# EAGLE design microPOV-a (EAGLE 6.4)
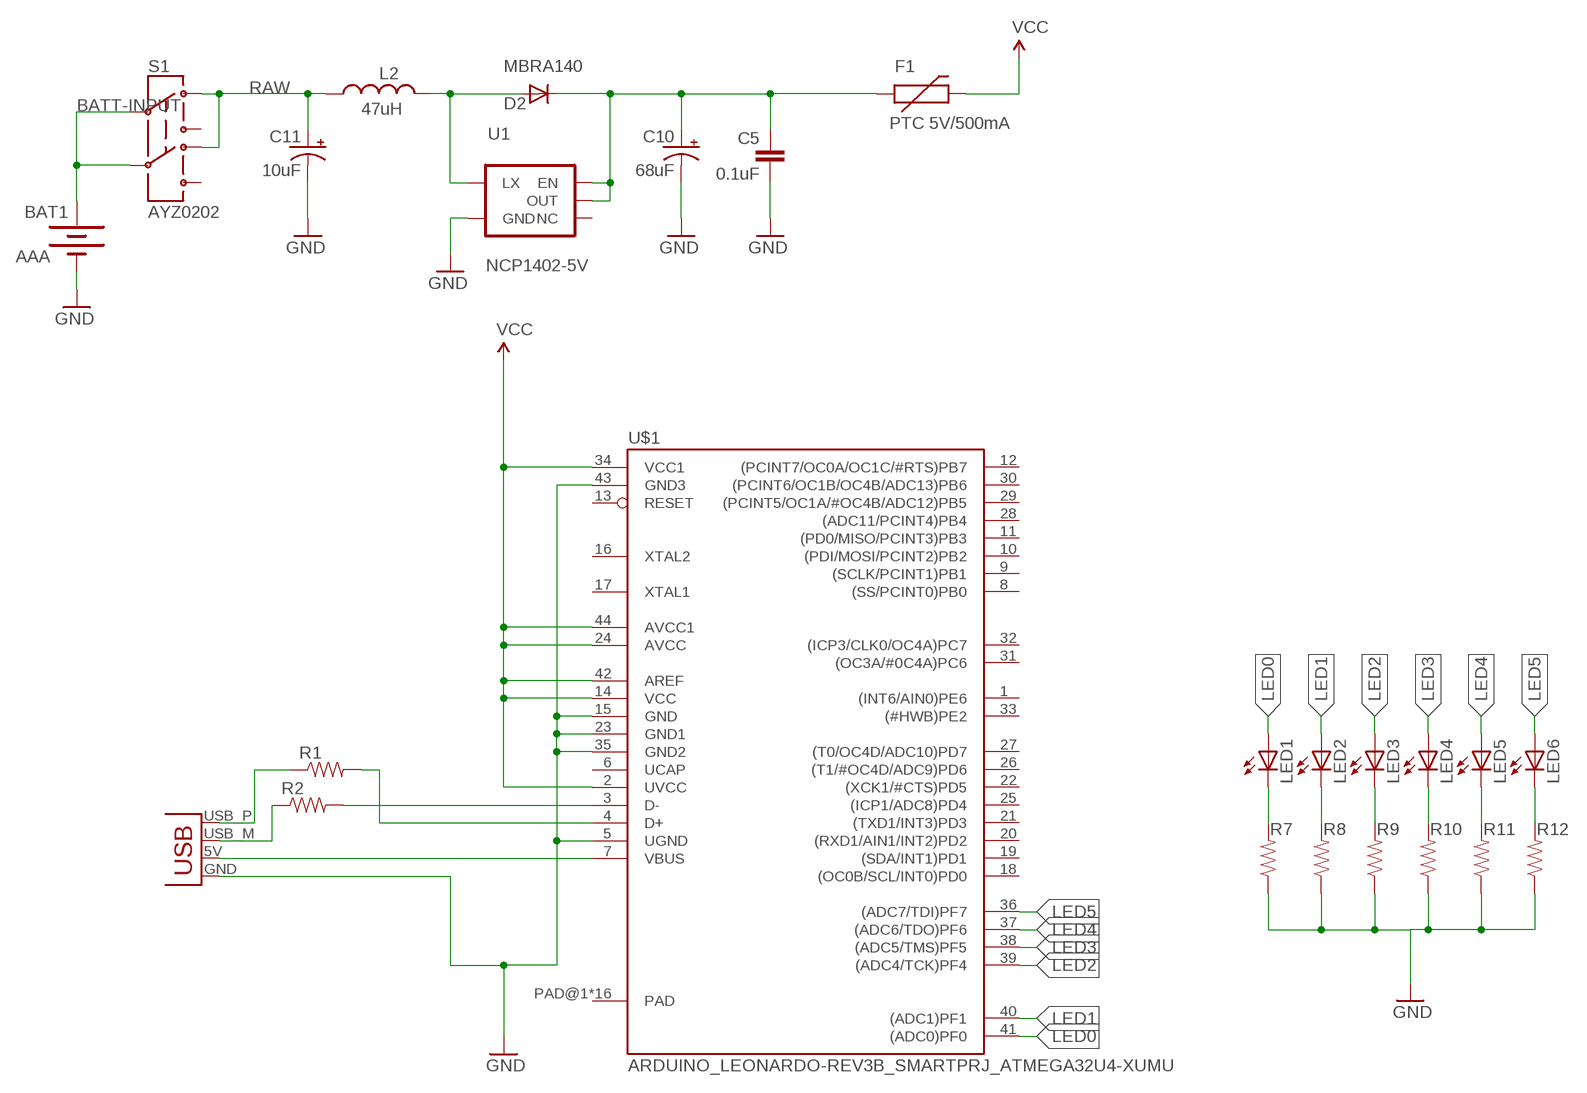
[diagram p0: schematic, sheet 1]

## Parts
BAT1  AAA  BATTERYAAA  [BATTERY-AAA]
C5  0.1uF  CAP0603-CAP  [0603-CAP]
C10  68uF  CAP_POL2  [EIA3528-21]
C11  10uF  CAP_POL1206  [CPOL_1206]
D2  MBRA140  DIODESMA  [SMA-DIODE]
F1  PTC 5V/500mA  PTCSMD  [PTC-1206]
JP1  USBPCB  [USB-A-PCB]
L2  47uH  INDUCTORCR54  [CR54]
LED1  LEDCHIPLED_1206  [CHIPLED_1206]
LED2  LEDCHIPLED_1206  [CHIPLED_1206]
LED3  LEDCHIPLED_1206  [CHIPLED_1206]
LED4  LEDCHIPLED_1206  [CHIPLED_1206]
LED5  LEDCHIPLED_1206  [CHIPLED_1206]
LED6  LEDCHIPLED_1206  [CHIPLED_1206]
R1  RESISTOR0402-RES  [0402-RES]
R2  RESISTOR0402-RES  [0402-RES]
R7  RESISTOR0402-RES  [0402-RES]
R8  RESISTOR0402-RES  [0402-RES]
R9  RESISTOR0402-RES  [0402-RES]
R10  RESISTOR0402-RES  [0402-RES]
R11  RESISTOR0402-RES  [0402-RES]
R12  RESISTOR0402-RES  [0402-RES]
S1  AYZ0202  [AYZ0202]
U1  NCP1402-5V  V_REG_NCP1400SOT23-5  [SOT23-5]
U$1  ARDUINO_LEONARDO-REV3B_SMARTPRJ_ATMEGA32U4-XUMU  [ARDUINO_LEONARDO-REV3B_SMARTPRJ_QFN44ML7X7]

## Nets
BATT-INPUT: BAT1.PWR@1(+) S1.2 S1.5
GND: BAT1.GND@1(-) C5.2 C10.C(-) C11.C(-) JP1.GND R7.1 R8.1 R9.1 R10.1 R11.1 R12.1 U1.4(GND) U$1.5(UGND) U$1.15(GND) U$1.23(GND1) U$1.35(GND2) U$1.43(GND3)
LED0: LED1.A U$1.41((ADC0)PF0)
LED1: LED2.A U$1.40((ADC1)PF1)
LED2: LED3.A U$1.39((ADC4/TCK)PF4)
LED3: LED4.A U$1.38((ADC5/TMS)PF5)
LED4: LED5.A U$1.37((ADC6/TDO)PF6)
LED5: LED6.A U$1.36((ADC7/TDI)PF7)
N$1: JP1.5V(VBUS) U$1.7(VBUS)
N$2: C5.1 C10.A(+) D2.C F1.1 U1.1(EN) U1.2(OUT)
N$4: JP1.USB_P(D+) R1.1
N$5: R1.2 U$1.4(D+)
N$6: JP1.USB_M(D-) R2.1
N$7: R2.2 U$1.3(D-)
N$8: LED1.C R7.2
N$9: LED2.C R8.2
N$10: LED3.C R9.2
N$11: LED4.C R10.2
N$12: LED5.C R11.2
N$13: LED6.C R12.2
N$16: D2.A L2.P$1 U1.5(LX)
RAW: C11.A(+) L2.P$2 S1.3 S1.6
VCC: F1.2 U$1.2(UVCC) U$1.14(VCC) U$1.24(AVCC) U$1.34(VCC1) U$1.42(AREF) U$1.44(AVCC1)
Unconnected: S1.1 S1.4 U1.3(NC) U$1.1((INT6/AIN0)PE6) U$1.6(UCAP) U$1.8((SS/PCINT0)PB0) U$1.9((SCLK/PCINT1)PB1) U$1.10((PDI/MOSI/PCINT2)PB2) U$1.11((PD0/MISO/PCINT3)PB3) U$1.12((PCINT7/OC0A/OC1C/#RTS)PB7) U$1.13(RESET) U$1.16(XTAL2) U$1.17(XTAL1) U$1.18((OC0B/SCL/INT0)PD0) U$1.19((SDA/INT1)PD1) U$1.20((RXD1/AIN1/INT2)PD2) U$1.21((TXD1/INT3)PD3) U$1.22((XCK1/#CTS)PD5) U$1.25((ICP1/ADC8)PD4) U$1.26((T1/#OC4D/ADC9)PD6) U$1.27((T0/OC4D/ADC10)PD7) U$1.28((ADC11/PCINT4)PB4) U$1.29((PCINT5/OC1A/#OC4B/ADC12)PB5) U$1.30((PCINT6/OC1B/OC4B/ADC13)PB6) U$1.31((OC3A/#0C4A)PC6) U$1.32((ICP3/CLK0/OC4A)PC7) U$1.33((#HWB)PE2)

## Power pins joined to a net without a drawn wire
PAD: U$1.PAD@1(PAD) U$1.PAD@2(PAD) U$1.PAD@3(PAD) U$1.PAD@4(PAD) U$1.PAD@5(PAD) U$1.PAD@6(PAD) U$1.PAD@7(PAD) U$1.PAD@8(PAD) U$1.PAD@9(PAD) U$1.PAD@10(PAD) U$1.PAD@11(PAD) U$1.PAD@12(PAD) U$1.PAD@13(PAD) U$1.PAD@14(PAD) U$1.PAD@15(PAD) U$1.PAD@16(PAD)

## Library data of the parts
BAT1 = SparkFun:BATTERY: Battery Holders Various common sizes : AA, AAA, 20mm coin cell and 12mm coin cell.
C5 = SparkFun:CAP: Capacitor Standard 0603 ceramic capacitor, and 0.1" leaded capacitor.
C10 C11 = SparkFun-Nate:CAP_POL
D2 = SparkFun-Nate:DIODE
F1 = SparkFun:PTC: Resettable Fuse PTC Resettable Fuse. Spark Fun Electronics SKU : COM-08357
JP1 = SparkFun-Connectors:USB: USB Connectors USB-B-PTH is fully proven SKU : PRT-00139/CONN-08278 USB-miniB is fully proven SKU : PRT-00587 USB-A-PCB is untested. USB-A-H is throughly reviewed, but untested. Spark Fun Electronics SKU : PRT-00437 USB-B-SMT is throughly reviewed, but untested. Needs silkscreen touching up. USB-A-S has not been used/tested USB-MB-H has not been used/tested USB-MICROB has been used. CONN-09505
L2 = SparkFun-Nate:INDUCTOR: Basic Inductor/Choke - 0603 and 1206
LED1-LED6 = adafruit:LED: LED OSRAM: - CHIPLED LG R971, LG N971, LY N971, LG Q971, LY Q971, LO R971, LY R971 LH N974, LH R974 LS Q976, LO Q976, LY Q976 LO Q996 - Hyper CHIPLED LW Q18S LB Q993, LB Q99A, LB R99A - SideLED LS A670, LO A670, LY A670, LG A670, LP A670 LB A673, LV A673, LT A673, LW A673 LH A674 LY A675 LS A676, LA A676, LO A676, LY A676, LW A676 LS A679, LY A679, LG A679 - Hyper Micro SIDELED® LS Y876, LA Y876, LO Y876, LY Y876 LT Y87S - SmartLED LW L88C, LW L88S LB L89C, LB L89S, LG L890 LS L89K, LO L89K, LY L89K LS L896, LA L896, LO L896, LY L896 - TOPLED LS T670, LO T670, LY T670, LG T670, LP T670 LSG T670, LSP T670, LSY T670, LOP T670, LYG T670 LG T671, LOG T671, LSG T671 LB T673, LV T673, LT T673, LW T673 LH T674 LS T676, LA T676, LO T676, LY T676, LB T676, LH T676, LSB T676, LW T676 LB T67C, LV T67C, LT T67C, LS T67K, LO T67K, LY T67K, LW E67C LS E67B, LA E67B, LO E67B, LY E67B, LB E67C, LV E67C, LT E67C LW T67C LS T679, LY T679, LG T679 LS T770, LO T770, LY T770, LG T770, LP T770 LB T773, LV T773, LT T773, LW T773 LH T774 LS E675, LA E675, LY E675, LS T675 LS T776, LA T776, LO T776, LY T776, LB T776 LHGB T686 LT T68C, LB T68C - Hyper Mini TOPLED® LB M676 - Mini TOPLED Santana® LG M470 LS M47K, LO M47K, LY M47K Source: http://www.osram.convergy.de/
R1 R2 = SparkFun-Passives:RESISTOR: Resistor Basic schematic elements and footprints for 0603, 1206, and PTH resistors.
R7-R12 = SparkFun:RESISTOR: Resistor Basic schematic elements and footprints for 0603, 1206, and PTH resistors.
S1 = SparkFun:AYZ0202: SPDT Slide Switch Simple SMD single-pull double-throw slide switch. Good for less than 350mA power switch, switching UARTs between devices, etc. Spark Fun Electronics SKU : COM-00597
U1 = SparkFun:V_REG_NCP1400: Switching step-up voltage regulator NCP1400 switiching regulator takes single cell AA and outputs 100mA at 3.3V or 5V with minimal number of external components.
U$1 = blinkiverse:ARDUINO_LEONARDO-REV3B_SMARTPRJ_ATMEGA32U4-XU

## Board
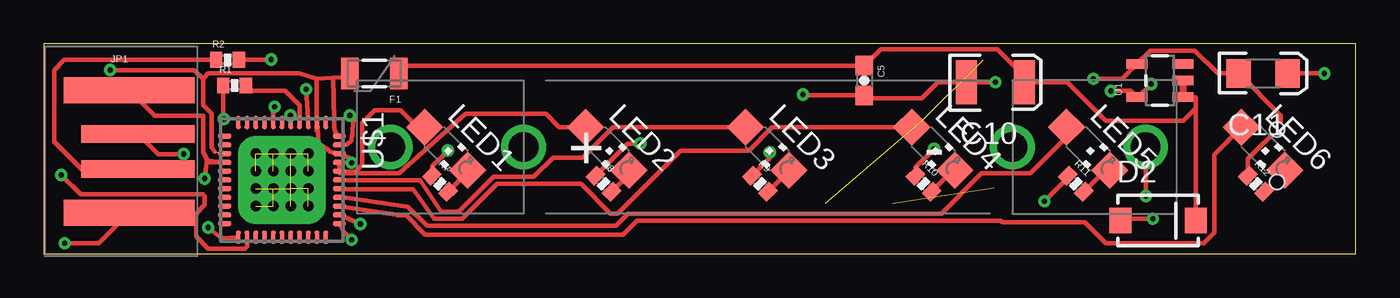
[diagram p1: board, top side]
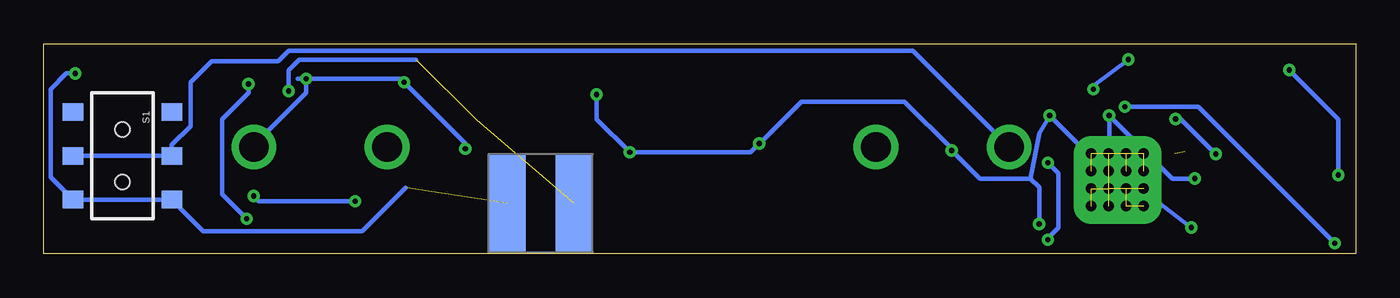
[diagram p2: board, bottom side, seen from below]

Size 75 x 12 mm. Coordinates in mm from the lower left corner, seen from the top.
Outline: 0,0 75,0 75,12 0,12 0,0
Copper layers (1*16): Top 0.035mm / dielectric 1.5mm / Bottom 0.035mm
Design rules "default": minimum track width 10mil, minimum drill 24mil, track to track 8mil, track to pad 8mil, pad to pad 8mil, via to via 8mil, smd to smd 8mil, copper to edge 40mil, drill to drill 8mil, minimum pad ring 10mil, minimum via ring 8mil, stop-mask expansion 4mil, vias tented up to drill 0mil, thermal gap 10mil

### Footprints (pad centres in the part's own frame; a part is rotated, then mirrored left to right if it is on the bottom)
BATTERY-AAA = drill 1.702: GND@1 21.59,0; GND@2 13.97,0; PWR@1 -21.59,0; PWR@2 -13.97,0
0603-CAP = smd 1.1 x 1: 1 -0.85,0; 2 0.85,0
EIA3528-21 = smd 2.5 x 1.2: A 0,-1.65; C 0,1.65
CPOL_1206 = smd 1.6 x 1.4: A 0,-1.4; C 0,1.4
SMA-DIODE = smd 1.27 x 1.47: A -2.15,0; C 2.15,0
PTC-1206 = smd 1 x 1.8: 1 -1.4,0; 2 1.4,0
USB-A-PCB = smd 7.5 x 1.5: 5V -0.2,-3.5; GND -0.2,3.5 | smd 6.5 x 1: USB_M 0.3,-1; USB_P 0.3,1
CR54 = smd 5.5 x 2.15: P$1 0,1.92; P$2 0,-1.92
CHIPLED_1206 = smd 1.5 x 1.5: A 0,-1.75; C 0,1.75
0402-RES = smd 0.7 x 0.9: 1 -0.65,0; 2 0.65,0
AYZ0202 = smd 1 x 1.15: 1 -2.5,2.825; 2 0,2.825; 3 2.5,2.825; 4 -2.5,-2.825; 5 0,-2.825; 6 2.5,-2.825 | hole 0.85: 1.5,0; -1.5,0
SOT23-5 = smd 0.55 x 1.2: 1 -0.95,-1.3; 2 0,-1.3; 3 0.95,-1.3; 4 0.95,1.3; 5 -0.95,1.3
ARDUINO_LEONARDO-REV3B_SMARTPRJ_QFN44ML7X7 = smd 0.75 x 0.275: 1 -3.275,2.5; 2 -3.275,2; 3 -3.275,1.5; 4 -3.275,1; 5 -3.275,0.5; 6 -3.275,0; 7 -3.275,-0.5; 8 -3.275,-1; 9 -3.275,-1.5; 10 -3.275,-2; 11 -3.275,-2.5; 23 3.275,-2.5; 24 3.275,-2; 25 3.275,-1.5; 26 3.275,-1; 27 3.275,-0.5; 28 3.275,0; 29 3.275,0.5; 30 3.275,1; 31 3.275,1.5; 32 3.275,2; 33 3.275,2.5 | smd 0.275 x 0.75: 12 -2.5,-3.275; 13 -2,-3.275; 14 -1.5,-3.275; 15 -1,-3.275; 16 -0.5,-3.275; 17 0,-3.275; 18 0.5,-3.275; 19 1,-3.275; 20 1.5,-3.275; 21 2,-3.275; 22 2.5,-3.275; 34 2.5,3.275; 35 2,3.275; 36 1.5,3.275; 37 1,3.275; 38 0.5,3.275; 39 0,3.275; 40 -0.5,3.275; 41 -1,3.275; 42 -1.5,3.275; 43 -2,3.275; 44 -2.5,3.275 | drill 0.6 pad 2: PAD@1 -1.5,1.5; PAD@4 1.5,1.5; PAD@13 -1.5,-1.5; PAD@16 1.5,-1.5 | drill 0.6 pad 2 square: PAD@2 -0.5,1.5; PAD@3 0.5,1.5; PAD@5 -1.5,0.5; PAD@8 1.5,0.5; PAD@9 -1.5,-0.5; PAD@12 1.5,-0.5; PAD@14 -0.5,-1.5; PAD@15 0.5,-1.5 | drill 0.6 pad 1 square: PAD@6 -0.5,0.5; PAD@7 0.5,0.5; PAD@10 -0.5,-0.5; PAD@11 0.5,-0.5

### Placement (x,y rotation side)
BAT1  41.4,6.1 0 top
C5  46.9,9.9 270 top
C10  54.4,9.8 90 top
C11  69.7,10.3 90 top
D2  63.7,1.9 0 top
F1  18.9,10.3 180 top
JP1  5.08,5.85 0 top
L2  46.6,2.9 270 bottom
LED1  23,6 225 top
LED2  32.21,6 225 top
LED3  41.35,6 225 top
LED4  50.85,6 225 top
LED5  59.71,6 225 top
LED6  69.71,6 225 top
R1  10.91,9.62 0 top
R2  10.51,11.08 0 top
R7  22.65,4 315 top
R8  32,4 315 top
R9  40.94,4 315 top
R10  50.29,4 315 top
R11  59,4 315 top
R12  69.29,4 315 top
S1  70.5,5.6 270 bottom
U1  63.8,9.9 90 top
U$1  13.62,4.22 270 top

### Tracks (layer width: path | path; a pad name or v marks a point on that pad's centre or on a via)
BATT-INPUT
  Bottom 0.254: S1.5 S1.2 67.67,6.22 66.6,7.3 66.6,9.8 65.4,11 61.6,11 61,11.6 25.31,11.6 BAT1.PWR@1
GND  (via drill 0.3)
  Top 0.254: v60,10 61.65,10 U1.4 63.25,11.6 65.8,11.6 67.1,10.3 C11.C 70.7,7.9 70.7,7.3 68.83,5.43 R12.1 | BAT1.GND@1 v63,3.3 | v57.2,3 58.54,4.34 R11.1 | v54.4,9.8 C10.C 51.1,9.8 50.2,8.9 47.05,8.9 C5.2 43.45,9.05 v43.4,9.1 | v50.9,6 49.83,4.93 R10.1 | R9.1 41.5,5.48 v41.5,5.8 | R8.1 33.38,6.3 v34.1,6.3 | R7.1 22.19,4.99 v23.1,5.9 | U$1.5 14.12,7.88 v14.1,7.9 | v9.4,1.5 10.18,0.9 U$1.23 | JP1.GND 6.33,7.9 9.1,7.9 9.1,5.8 9.38,5.32 U$1.15 9.32,5.22 v9.2,4.3 | U$1.43 17.32,6.22 17.6,6.5 17.7,7.7 v17.5,7.9 | U$1.35 18.08,1.72 v18.1,1.7
  Bottom 0.254: BAT1.GND@1 62.99,6.21 60,9.2 v60,10 | v63,3.3 62.7,3 v57.2,3 | v50.9,6 50.9,6.3 v54.4,9.8 54.6,10 v60,10 | 60.5,10 v60,10 | v43.4,9.1 43.4,7.7 v41.5,5.8 34.6,5.8 v34.1,6.3 31.7,8.7 25.8,8.7 23.1,6 v23.1,5.9 21.5,4.3 18.6,4.3 | 14.1,5.1 v14.1,7.9 10.5,4.3 v9.2,4.3 | 14.1,5.1 v9.4,1.5 | 18.6,4.3 18.1,6.9 v17.5,7.9 14.7,5.1 14.1,5.1 | v18.1,1.7 18.1,3.8 18.6,4.3
LED0
  Top 0.254: LED1.A 21.36,7.24 20.4,8.2 18.9,8.2 18.2,7.5 18.2,5.1 17.8,4.7 16.91,4.7 U$1.41
LED1
  Top 0.254: LED2.A 29.46,7.24 28.7,8 24.1,8 20.3,4.6 16.91,4.6 U$1.40
LED2
  Top 0.254: LED3.A 32.54,7.24 30.8,5.5 29.1,5.5 28,4.4 25.7,4.4 23.7,2.4 22.7,2.4 21.5,4.2 17.18,4.2 U$1.39
LED3
  Top 0.254: LED4.A 41.64,7.24 40.3,5.9 36.4,5.9 32.8,2.3 32.4,2.3 30.7,4 25.9,4 23.9,2 22.3,2 21.1,3.7 16.91,3.7 U$1.38
LED4
  Top 0.254: LED5.A 58.47,6.67 56.4,4.6 53.6,4.6 51.3,2.3 33.4,2.3 32.7,1.6 21.9,1.6 20.8,2.7 17.32,3.2 U$1.37
LED5
  Top 0.254: LED6.A 66.9,5.67 66.9,1.2 66.3,0.6 60.7,0.6 59.5,1.8 54.8,1.8 54.7,1.9 33.9,1.9 33.1,1.1 21.8,1.1 20.7,2.2 20.2,2.2 20.18,2.22 U$1.36
N$1  (via drill 0.3)
  Top 0.254: U$1.7 13.12,8.32 v13.2,8.4 | v1.2,0.6 3.13,0.6 JP1.5V
  Bottom 0.254: v13.2,8.4 9,8.4 v1.2,0.6
N$2
  Top 0.254: U1.1 65.85,8.95 65.85,8.3 | 65.85,8.3 D2.C | 65.85,8.3 65.15,7.6 60.7,7.6 58.5,9.8 C10.A 56.05,10.15 54.5,11.7 47.85,11.7 C5.1 20.75,10.75 F1.1
  Top 0.406: U1.2 U1.1
N$4  (via drill 0.3)
  Top 0.254: R1.1 10.26,7.74 v10.3,7.7 | v8,5.7 6.53,5.7 JP1.USB_P
  Bottom 0.254: v10.3,7.7 10,7.7 v8,5.7
N$5
  Top 0.254: U$1.4 14.62,8.48 13.8,9.3 11.88,9.3 R1.2
N$6
  Top 0.254: R2.1 1.18,11.08 0.6,10.5 0.6,6.4 2.2,4.8 5.33,4.8 JP1.USB_M
N$7  (via drill 0.3)
  Top 0.254: U$1.3 15.12,7.68 v15,9.4 | v13,11.1 11.18,11.1 R2.2
  Bottom 0.254: v15,9.4 14.9,9.7 v13,11.1
N$8
  Top 0.254: LED1.C 24.24,4.67 R7.2
N$9
  Top 0.254: LED2.C 33.45,4.53 R8.2
N$10
  Top 0.254: LED3.C 42.59,4.73 R9.2
N$11
  Top 0.254: LED4.C 51.98,4.76 R10.2
N$12
  Top 0.254: LED5.C 60.68,4.76 R11.2
N$13
  Top 0.254: LED6.C 70.94,4.73 R12.2
N$16  (via drill 0.3)  (2 unrouted)
  Top 0.254: v61,9.3 62.15,9.3 U1.5 62.55,8.95 v63.3,9.7 | v63.4,2 61.65,2 D2.A
  Bottom 0.254: 53.7,11.1 60.4,11.1 61,10.5 v61,9.3 | v63.3,9.7 63.3,9.2 64.8,7.7 64.8,3.4 v63.4,2
PAD  (15 unrouted)
RAW  (via drill 0.3)  (1 unrouted)
  Top 0.254: C11.A v73.2,10.3
  Bottom 0.254: v73.2,10.3 73.7,10.3 74.6,9.4 74.6,4.38 S1.6 S1.3 65.88,1.3 56.8,1.3 54.32,3.78
VCC  (via drill 0.3)  (1 unrouted)
  Top 0.254: F1.2 17.5,10.1 16.55,10.05 | 16.55,10.05 15.6,10 | 15.6,10 15.6,7.01 U$1.2 15.7,6.32 16.2,6 16.38,5.82 U$1.42 17.41,5.5 v17.6,5.2 | 9.78,5.82 9.6,6.1 9.6,8 9.1,8.5 9.1,10 | 15.6,10 14.6,10.3 9.4,10.3 9.1,10 | U$1.44 16.68,6.92 16.6,7.2 16.6,7.7 16.55,10.05 | U$1.34 17.18,1.22 v17.6,0.8 | U$1.24 11.62,0.42 11.5,0.3 9.4,0.3 8.7,1 8.7,2.3 9.2,2.8 9.2,3.3 9.1,3.4 2.1,3.4 v1,4.5 | v3.8,10.5 8.6,10.5 9.1,10
  Bottom 0.254: v17.6,0.8 17.6,0.9 17,1.5 17,4.6 v17.6,5.2 | v1,4.5 1,7.7 v3.8,10.5